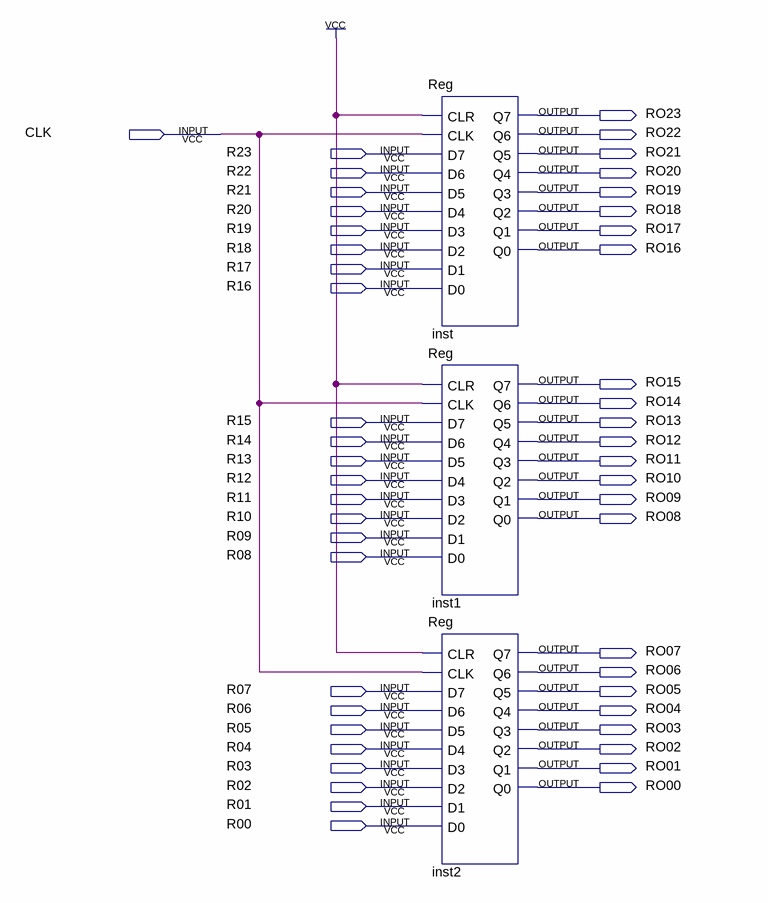
[diagram p0: schematic sheet]
// Quartus schematic uIR.bdf as structural Verilog: 3 symbols, 49 pins
module uIR (
  input  CLK,
  input  R23,
  input  R22,
  input  R21,
  input  R20,
  input  R19,
  input  R18,
  input  R17,
  input  R16,
  input  R15,
  input  R14,
  input  R13,
  input  R12,
  input  R11,
  input  R10,
  input  R09,
  input  R08,
  input  R07,
  input  R06,
  input  R05,
  input  R04,
  input  R03,
  input  R02,
  input  R01,
  input  R00,
  output RO23,
  output RO22,
  output RO21,
  output RO20,
  output RO19,
  output RO18,
  output RO17,
  output RO16,
  output RO15,
  output RO14,
  output RO13,
  output RO12,
  output RO11,
  output RO10,
  output RO09,
  output RO08,
  output RO07,
  output RO06,
  output RO05,
  output RO04,
  output RO03,
  output RO02,
  output RO01,
  output RO00
);

  Reg inst (
    .CLR(1'b1), .CLK(CLK), .D7(R23), .D6(R22), .D5(R21), .D4(R20), .D3(R19), .D2(R18), .D1(R17), .D0(R16),
    .Q7(RO23), .Q6(RO22), .Q5(RO21), .Q4(RO20), .Q3(RO19), .Q2(RO18), .Q1(RO17), .Q0(RO16));
  Reg inst1 (
    .CLR(1'b1), .CLK(CLK), .D7(R15), .D6(R14), .D5(R13), .D4(R12), .D3(R11), .D2(R10), .D1(R09), .D0(R08),
    .Q7(RO15), .Q6(RO14), .Q5(RO13), .Q4(RO12), .Q3(RO11), .Q2(RO10), .Q1(RO09), .Q0(RO08));
  Reg inst2 (
    .CLR(1'b1), .CLK(CLK), .D7(R07), .D6(R06), .D5(R05), .D4(R04), .D3(R03), .D2(R02), .D1(R01), .D0(R00),
    .Q7(RO07), .Q6(RO06), .Q5(RO05), .Q4(RO04), .Q3(RO03), .Q2(RO02), .Q1(RO01), .Q0(RO00));
endmodule
